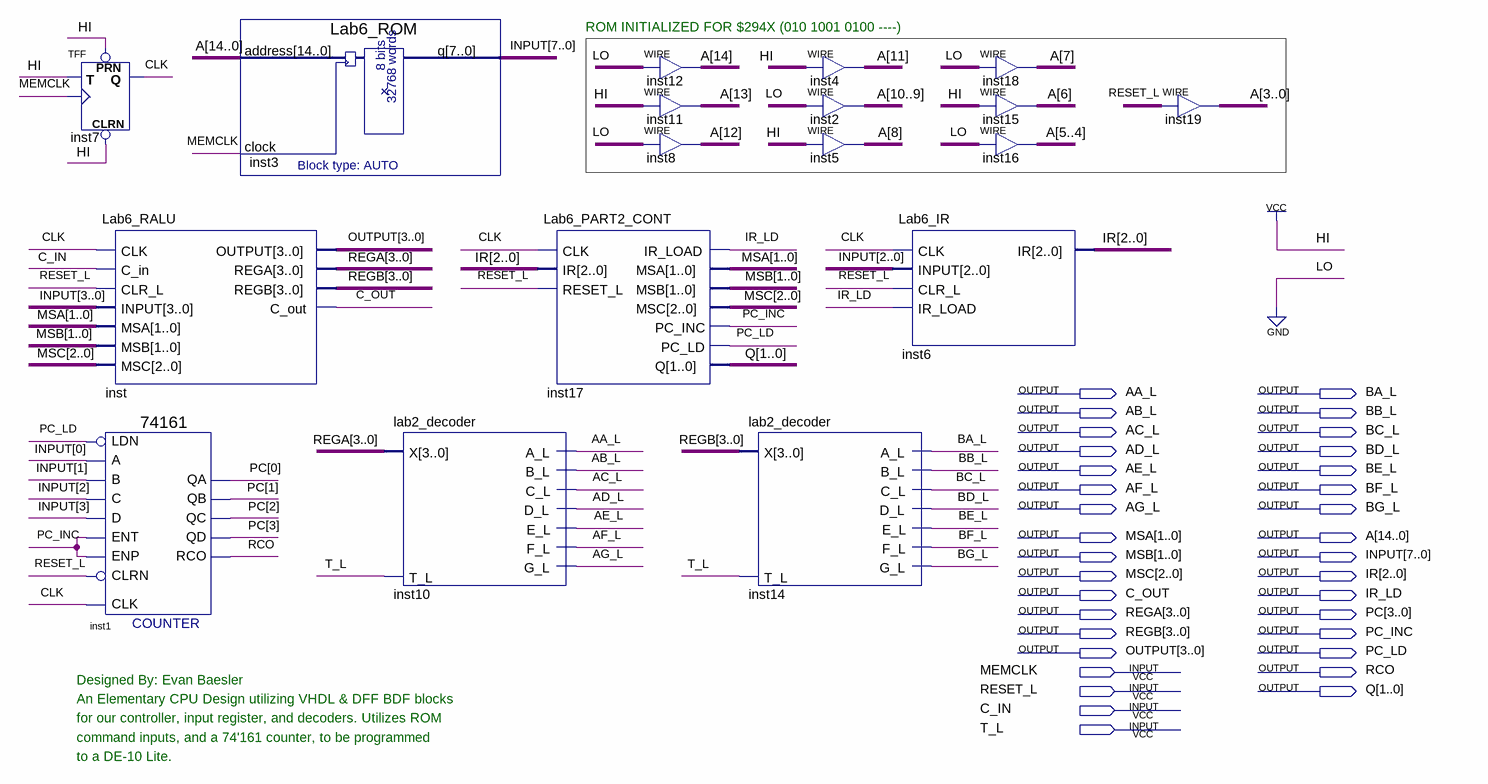
[diagram p0: schematic sheet]
// Quartus schematic Lab6_PART2.bdf as structural Verilog: 18 symbols, 34 pins
module Lab6_PART2 (
  input  MEMCLK,
  input  RESET_L,
  input  C_IN,
  input  T_L,
  output AA_L,
  output BA_L,
  output AB_L,
  output BB_L,
  output AC_L,
  output BC_L,
  output AD_L,
  output BD_L,
  output AE_L,
  output BE_L,
  output AF_L,
  output BF_L,
  output AG_L,
  output BG_L,
  output [1:0] MSA,
  output [14:0] A,
  output [1:0] MSB,
  output [7:0] INPUT,
  output [2:0] MSC,
  output [2:0] IR,
  output C_OUT,
  output IR_LD,
  output [3:0] REGA,
  output [3:0] PC,
  output [3:0] REGB,
  output PC_INC,
  output [3:0] OUTPUT,
  output PC_LD,
  output RCO,
  output [1:0] Q
);

  wire CLK;

  TFF inst7 (.PRN(1'b1), .CLRN(1'b1), .T(1'b1), .CLK(MEMCLK), .Q(CLK));
  Lab6_RALU inst (
    .CLK(CLK), .C_in(C_IN), .CLR_L(RESET_L), .INPUT(INPUT[3:0]), .MSA(MSA), .MSB(MSB), .MSC(MSC),
    .OUTPUT(OUTPUT), .REGA(REGA), .REGB(REGB), .C_out(C_OUT));
  \74161  inst1 (
    .CLRN(RESET_L), .CLK(CLK), .ENP(PC_INC), .LDN(PC_LD), .A(INPUT[0]), .D(INPUT[3]), .ENT(PC_INC),
    .B(INPUT[1]), .C(INPUT[2]), .QD(PC[3]), .QC(PC[2]), .QB(PC[1]), .QA(PC[0]), .RCO(RCO));
  Lab6_ROM inst3 (.address(A), .clock(MEMCLK), .q(INPUT));
  lab2_decoder inst10 (
    .X(REGA), .T_L(T_L), .C_L(AC_L), .D_L(AD_L), .A_L(AA_L), .E_L(AE_L), .B_L(AB_L), .F_L(AF_L), .G_L(AG_L));
  Lab6_PART2_CONT inst17 (
    .CLK(CLK), .IR(IR), .RESET_L(RESET_L), .IR_LOAD(IR_LD), .MSA(MSA), .MSB(MSB), .MSC(MSC), .PC_INC(PC_INC),
    .PC_LD(PC_LD), .Q(Q));
  assign A[14] = 1'b0;  // WIRE inst12
  assign A[13] = 1'b1;  // WIRE inst11
  assign A[12] = 1'b0;  // WIRE inst8
  lab2_decoder inst14 (
    .X(REGB), .T_L(T_L), .C_L(BC_L), .D_L(BD_L), .A_L(BA_L), .E_L(BE_L), .B_L(BB_L), .F_L(BF_L), .G_L(BG_L));
  assign A[11] = 1'b1;  // WIRE inst4
  assign A[10:9] = 2'b00;  // WIRE inst2
  assign A[8] = 1'b1;  // WIRE inst5
  Lab6_IR inst6 (.CLK(CLK), .INPUT(INPUT[2:0]), .CLR_L(RESET_L), .IR_LOAD(IR_LD), .IR(IR));
  assign A[7] = 1'b0;  // WIRE inst18
  assign A[6] = 1'b1;  // WIRE inst15
  assign A[5:4] = 2'b00;  // WIRE inst16
  assign A[3:0] = {4{RESET_L}};  // WIRE inst19

  // Notes on the sheet:
  //   ROM INITIALIZED FOR $294X (010 1001 0100 ----)
  //   Designed By: Evan Baesler
  //   An Elementary CPU Design utilizing VHDL & DFF BDF blocks
  //   for our controller, input register, and decoders. Utilizes ROM
  //   command inputs, and a 74'161 counter, to be programmed
  //   to a DE-10 Lite.
endmodule
